# EAGLE design breadBUG_v1 (EAGLE 6.1)
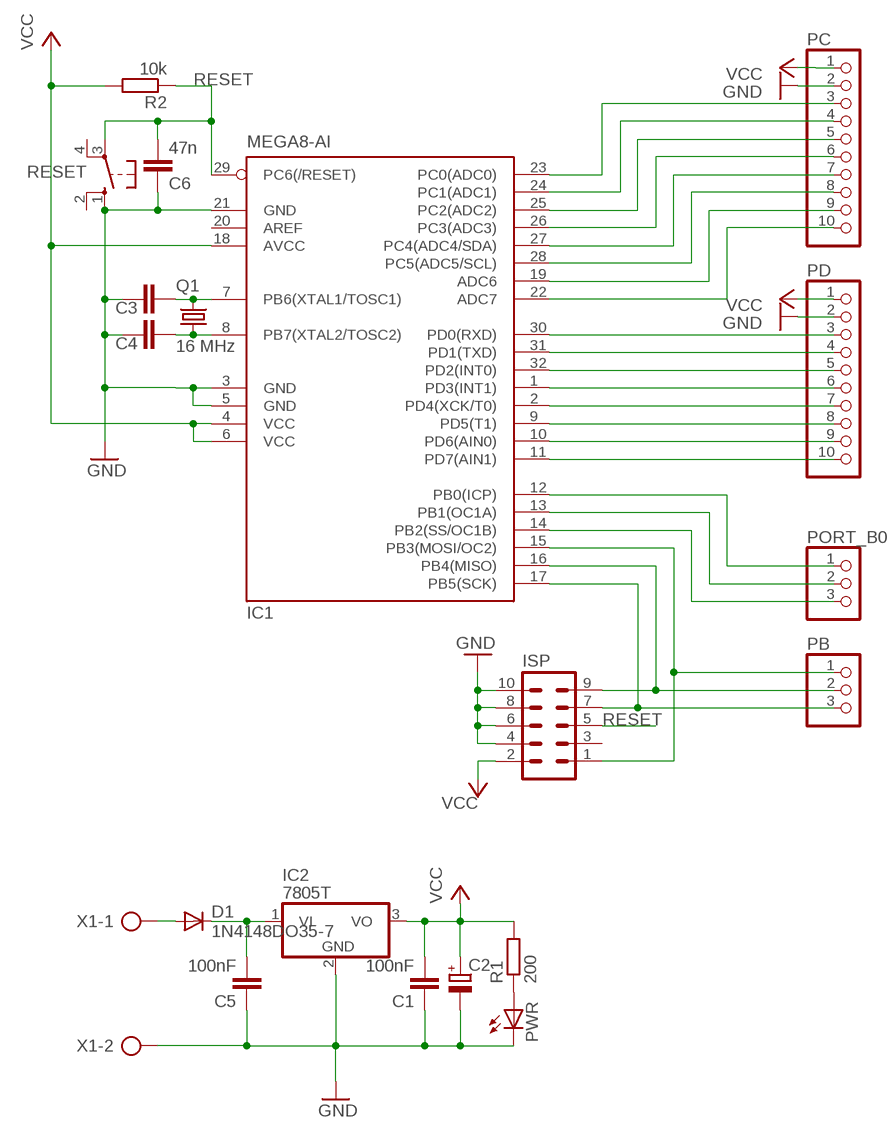
[diagram p0: schematic, sheet 1]

## Parts
C1  100nF  C2.5/2  [C2.5-2]
C2  CPOL-EUE2.5-6  [E2,5-6]
C3  C-EU025-025X050  [C025-025X050]
C4  C-EU025-025X050  [C025-025X050]
C5  100nF  C2.5/2  [C2.5-2]
C6  47n  C-EU025-025X050  [C025-025X050]
D1  1N4148DO35-7  [DO35-7]
IC1  MEGA8-AI  [TQFP32-08]
IC2  7805T  [TO220H]
ISP  MA05-2  [MA05-2]
PB  PINHD-1X3  [1X03]
PC  PINHD-1X10  [1X10]
PD  PINHD-1X10  [1X10]
PORT_B0  PINHD-1X3  [1X03]
PWR  LED3MM  [LED3MM]
Q1  16 MHz  CRYSTALHC49U-V  [HC49U-V]
R1  200  R-EU_0204/2V  [0204V]
R2  10k  R-EU_0204/2V  [0204V]
RESET  10-XX  [B3F-10XX]
X1  AK500/2  [AK500/2]

## Nets
GND: C1.1 C2.- C3.1 C4.1 C5.1 C6.1 IC1.3(GND) IC1.5(GND) IC1.21(GND) IC2.2(GND) ISP.4 ISP.6 ISP.8 ISP.10 PC.2 PD.2 PWR.K(C) RESET.1(S) X1.2
N$2: C3.2 IC1.7(PB6(XTAL1/TOSC1)) Q1.2
N$3: C4.2 IC1.8(PB7(XTAL2/TOSC2)) Q1.1
N$4: PWR.A R1.1
N$7: C5.2 D1.C IC2.1(VI)
N$8: D1.A X1.1
PB0: IC1.12(PB0(ICP)) PORT_B0.1
PB1: IC1.13(PB1(OC1A)) PORT_B0.2
PB2: IC1.14(PB2(SS/OC1B)) PORT_B0.3
PB3: IC1.15(PB3(MOSI/OC2)) ISP.1 PB.1
PB4: IC1.16(PB4(MISO)) ISP.9 PB.2
PB5: IC1.17(PB5(SCK)) ISP.7 PB.3
PC0: IC1.23(PC0(ADC0)) PC.3
PC1: IC1.24(PC1(ADC1)) PC.4
PC2: IC1.25(PC2(ADC2)) PC.5
PC3: IC1.26(PC3(ADC3)) PC.6
PC4: IC1.27(PC4(ADC4/SDA)) PC.7
PC5: IC1.28(PC5(ADC5/SCL)) PC.8
PC6: IC1.19(ADC6) PC.9
PC7: IC1.22(ADC7) PC.10
PD0: IC1.30(PD0(RXD)) PD.3
PD1: IC1.31(PD1(TXD)) PD.4
PD2: IC1.32(PD2(INT0)) PD.5
PD3: IC1.1(PD3(INT1)) PD.6
PD4: IC1.2(PD4(XCK/T0)) PD.7
PD5: IC1.9(PD5(T1)) PD.8
PD6: IC1.10(PD6(AIN0)) PD.9
PD7: IC1.11(PD7(AIN1)) PD.10
RESET: C6.2 IC1.29(PC6(/RESET)) ISP.5 R2.1 RESET.3(P)
VCC: C1.2 C2.+ IC1.4(VCC) IC1.6(VCC) IC1.18(AVCC) IC2.3(VO) ISP.2 PC.1 PD.1 R1.2 R2.2
Unconnected: IC1.20(AREF) ISP.3 RESET.2(S1) RESET.4(P1)

## Library data of the parts
C1 C5 = capacitor-wima:C: CAPACITOR naming: grid - package width
C2 = rcl:CPOL-EU: POLARIZED CAPACITOR, European symbol
C3 C4 C6 = rcl:C-EU: CAPACITOR, European symbol
D1 = diode:1N4148: DIODE high speed (Philips)
IC1 = atmel:MEGA8: MICROCONTROLLER 8 Kbytes FLASH, 1 kbytes SRAM, 512 bytes EEPROM, USART, 6-channel 10 bit ADC, 2-channel 8 bit ADC Pin compatible with Atmega48, ATMega88, ATMega168 Source: avr.lbr; MPN: ATMEGA8-16AU; OC_FARNELL: 9171371; OC_NEWARK: 73M8863
IC2 = linear:78*: Positive VOLTAGE REGULATOR Source: http://cache.national.com/ds/LM/LM78L05.pdf http://www.fairchildsemi.com/ds/LM/LM7805.pdf
ISP = con-lstb:MA05-2: PIN HEADER; OC_FARNELL: unknown; OC_NEWARK: unknown
PB PORT_B0 = pinhead:PINHD-1X3: PIN HEADER
PC PD = pinhead:PINHD-1X10: PIN HEADER
PWR = led:LED: LED OSRAM: - CHIPLED LG R971, LG N971, LY N971, LG Q971, LY Q971, LO R971, LY R971 LH N974, LH R974 LS Q976, LO Q976, LY Q976 LO Q996 - Hyper CHIPLED LW Q18S LB Q993, LB Q99A, LB R99A - SideLED LS A670, LO A670, LY A670, LG A670, LP A670 LB A673, LV A673, LT A673, LW A673 LH A674 LY A675 LS A676, LA A676, LO A676, LY A676, LW A676 LS A679, LY A679, LG A679 - Hyper Micro SIDELED® LS Y876, LA Y876, LO Y876, LY Y876 LT Y87S - SmartLED LW L88C, LW L88S LB L89C, LB L89S, LG L890 LS L89K, LO L89K, LY L89K LS L896, LA L896, LO L896, LY L896 - TOPLED LS T670, LO T670, LY T670, LG T670, LP T670 LSG T670, LSP T670, LSY T670, LOP T670, LYG T670 LG T671, LOG T671, LSG T671 LB T673, LV T673, LT T673, LW T673 LH T674 LS T676, LA T676, LO T676, LY T676, LB T676, LH T676, LSB T676, LW T676 LB T67C, LV T67C, LT T67C, LS T67K, LO T67K, LY T67K, LW E67C LS E67B, LA E67B, LO E67B, LY E67B, LB E67C, LV E67C, LT E67C LW T67C LS T679, LY T679, LG T679 LS T770, LO T770, LY T770, LG T770, LP T770 LB T773, LV T773, LT T773, LW T773 LH T774 LS E675, LA E675, LY E675, LS T675 LS T776, LA T776, LO T776, LY T776, LB T776 LHGB T686 LT T68C, LB T68C - Hyper Mini TOPLED® LB M676 - Mini TOPLED Santana® LG M470 LS M47K, LO M47K, LY M47K Source: http://www.osram.convergy.de LUXEON: - LUMILED® LXK2-PW12-R00, LXK2-PW12-S00, LXK2-PW14-U00, LXK2-PW14-V00 LXK2-PM12-R00, LXK2-PM12-S00, LXK2-PM14-U00 LXK2-PE12-Q00, LXK2-PE12-R00, LXK2-PE12-S00, LXK2-PE14-T00, LXK2-PE14-U00 LXK2-PB12-K00, LXK2-PB12-L00, LXK2-PB12-M00, LXK2-PB14-N00, LXK2-PB14-P00, LXK2-PB14-Q00 LXK2-PR12-L00, LXK2-PR12-M00, LXK2-PR14-Q00, LXK2-PR14-R00 LXK2-PD12-Q00, LXK2-PD12-R00, LXK2-PD12-S00 LXK2-PH12-R00, LXK2-PH12-S00 LXK2-PL12-P00, LXK2-PL12-Q00, LXK2-PL12-R00 Source: www.luxeon.com KINGBRIGHT: KA-3528ASYC Source: www.kingbright.com
Q1 = crystal:CRYSTAL: CRYSTAL; OC_FARNELL: 1666969; OC_NEWARK: unknown
R1 R2 = rcl:R-EU_: RESISTOR, European symbol
RESET = switch-omron:10-XX: OMRON SWITCH; MPN: B3F-1000; OC_FARNELL: 176432; OC_NEWARK: 36M3542
X1 = con-ptr500:AK500/2: CONNECTOR; OC_FARNELL: unknown; OC_NEWARK: unknown

## Board
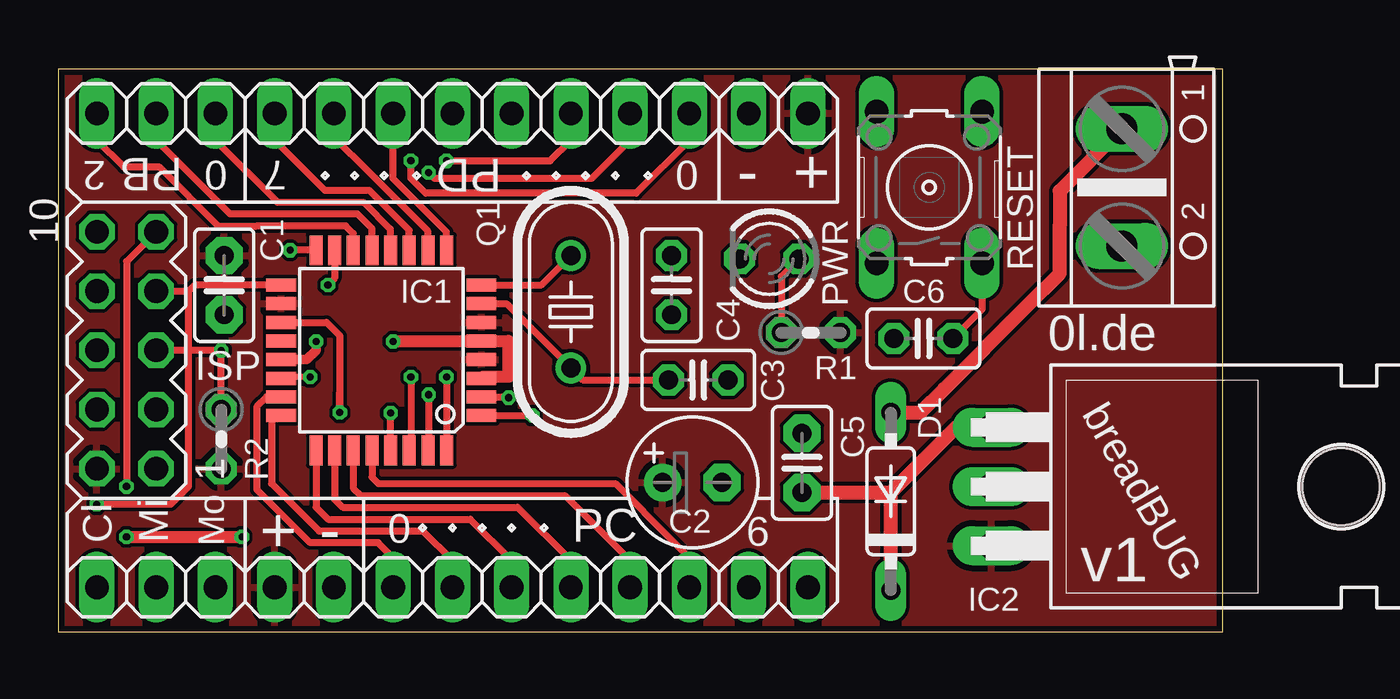
[diagram p1: board, top side]
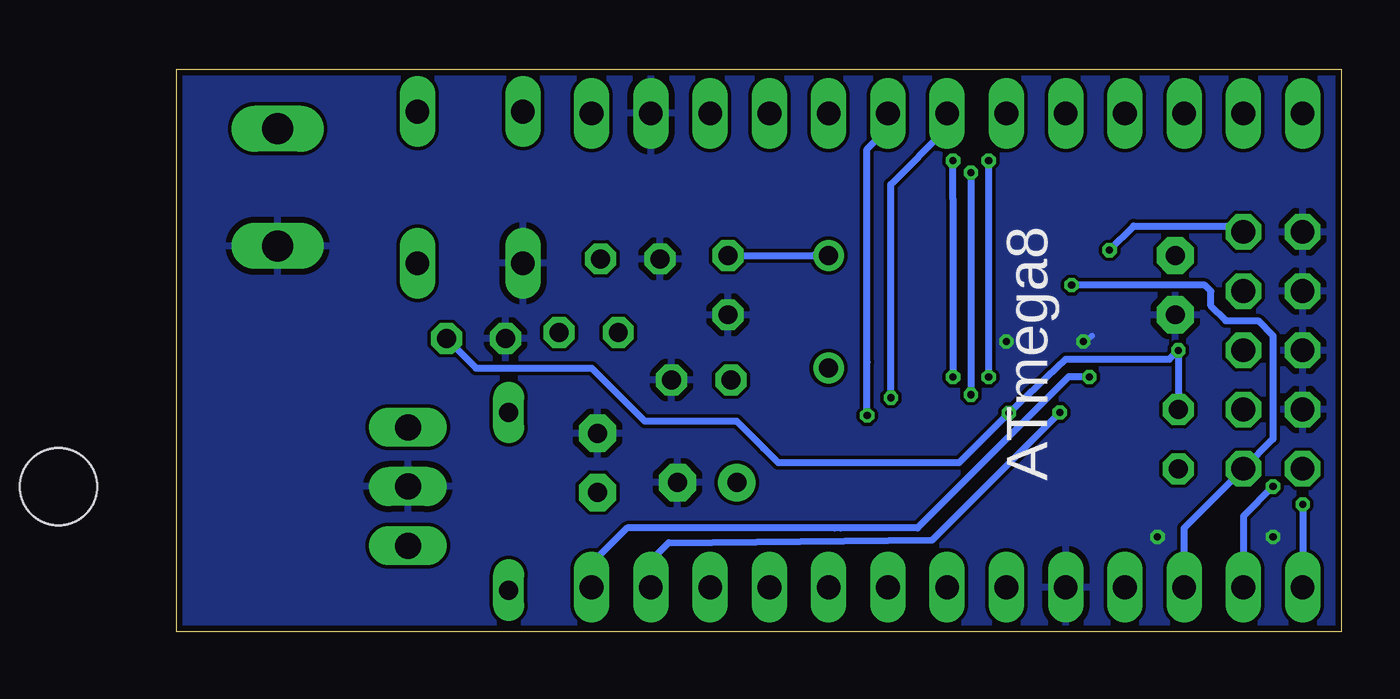
[diagram p2: board, bottom side, seen from below]

Size 49.91 x 24.13 mm. Coordinates in mm from the lower left corner, seen from the top.
Outline: 0,0 49.91,0 49.91,24.13 0,24.12 0,0
Copper layers (1*16): Top 0.035mm / dielectric 1.5mm / Bottom 0.035mm
Design rules: minimum track width 6mil, minimum drill 12mil, track to track 6mil, track to pad 6mil, pad to pad 6mil, via to via 6mil, smd to smd 0mil, copper to edge 10mil, drill to drill 10mil, minimum pad ring 10mil, minimum via ring 6mil, stop-mask expansion 2mil, vias tented up to drill 100mil, thermal gap 10mil

### Footprints (pad centres in the part's own frame; a part is rotated, then mirrored left to right if it is on the bottom)
C2.5-2 = drill 0.813 pad 1.6 octagon: 1 -1.27,0; 2 1.27,0
E2,5-6 = drill 0.813 pad 1.6: + -1.27,0 | drill 0.813 pad 1.6 octagon: - 1.27,0
C025-025X050 = drill 0.813 octagon: 1 -1.27,0; 2 1.27,0
DO35-7 = drill 0.813 long: A 3.81,0; C -3.81,0
TQFP32-08 = smd 1.27 x 0.559: 1 -4.293,2.8; 2 -4.293,2; 3 -4.293,1.2; 4 -4.293,0.4; 5 -4.293,-0.4; 6 -4.293,-1.2; 7 -4.293,-2; 8 -4.293,-2.8; 17 4.293,-2.8; 18 4.293,-2; 19 4.293,-1.2; 20 4.293,-0.4; 21 4.293,0.4; 22 4.293,1.2; 23 4.293,2; 24 4.293,2.8 | smd 0.559 x 1.27: 9 -2.8,-4.293; 10 -2,-4.293; 11 -1.2,-4.293; 12 -0.4,-4.293; 13 0.4,-4.293; 14 1.2,-4.293; 15 2,-4.293; 16 2.8,-4.293; 25 2.8,4.293; 26 2,4.293; 27 1.2,4.293; 28 0.4,4.293; 29 -0.4,4.293; 30 -1.2,4.293; 31 -2,4.293; 32 -2.8,4.293
TO220H = drill 1.118 long: 1 -2.54,-10.16; 2 0,-10.16; 3 2.54,-10.16 | hole 3.302: 0,4.826
MA05-2 = drill 1.016 octagon: 1 -5.08,-1.27; 2 -5.08,1.27; 3 -2.54,-1.27; 4 -2.54,1.27; 5 0,-1.27; 6 0,1.27; 7 2.54,-1.27; 8 2.54,1.27; 9 5.08,-1.27; 10 5.08,1.27
1X03 = drill 1.016 long: 1 -2.54,0; 2 0,0; 3 2.54,0
1X10 = drill 1.016 long: 1 -11.43,0; 2 -8.89,0; 3 -6.35,0; 4 -3.81,0; 5 -1.27,0; 6 1.27,0; 7 3.81,0; 8 6.35,0; 9 8.89,0; 10 11.43,0
LED3MM = drill 0.813 octagon: A -1.27,0; K 1.27,0
HC49U-V = drill 0.813: 1 -2.413,0; 2 2.413,0
0204V = drill 0.813 octagon: 1 -1.27,0; 2 1.27,0
B3F-10XX = drill 1.016 long: 1 -3.251,2.261; 2 3.251,2.261; 3 -3.251,-2.261; 4 3.251,-2.261
AK500/2 = drill 1.321 long: 1 -2.515,0; 2 2.515,0

### Placement (x,y rotation side)
C1  7.11,14.86 90 top
C2  27.18,6.39 0 top
C3  27.43,10.79 180 top
C4  26.29,14.86 90 top
C5  31.88,7.24 270 top
C6  37.08,12.57 0 top
D1  35.69,5.59 90 top
IC1  13.84,12.06 180 top
IC2  50.16,6.22 270 top
ISP  2.92,12.06 90 top
PB  4.19,1.91 180 top
PC  20.7,1.91 0 top
PD  20.7,22.23 180 top
PORT_B0  4.19,22.23 180 top
PWR  30.47,15.99 180 top
Q1  21.97,13.72 270 top
R1  32.26,12.83 0 top
R2  6.99,8.26 270 top
RESET  37.34,19.05 90 top
X1  45.59,19.05 270 top

### Tracks (layer width: path | path; a pad name or v marks a point on that pad's centre or on a via)
GND  (via drill 0.3)
  Top 0.406: IC1.21 10.65,11.66 11.05,12.06 v11.05,12.45
  Top 0.508: v2.92,4.06 3.17,4.06 v7.87,4.06 | IC1.5 19.29,12.46 19.3,12.45 | 19.3,12.45 19.3,10.92 | 19.3,10.92 18.19,10.92 IC1.3 | 19.3,10.92 19.3,12.45 | 19.3,12.45 v14.35,12.45
  Bottom 0.254: v11.05,12.45 10.67,12.7
  pour Bottom: 0,24.13 49.91,24.13 49.91,0 0,0
N$2
  Top 0.305: IC1.7 19.21,14.06 Q1.2 22.48,10.79 C3.2
N$3
  Top 0.305: IC1.8 20.71,14.87 Q1.1
  Bottom 0.305: C4.2 22.61,16.13 Q1.1
N$4
  Top 0.305: PWR.A 30.99,15.23 R1.1
N$7
  Top 0.61: C5.2 35.69,5.97 | 35.69,5.97 38.48,8.76 IC2.1 | D1.C 35.69,5.21 35.69,5.97
N$8
  Top 0.61: D1.A 36.96,9.4 37.97,10.41 41.53,13.97 42.93,15.37 42.93,17.4 42.93,18.9 X1.1
PB0
  Top 0.305: PORT_B0.1 6.73,21.08 9.4,18.41 13.08,18.41 14.22,17.27 14.22,16.38 IC1.12
PB1
  Top 0.305: IC1.13 13.44,17.29 12.95,17.78 12.83,17.91 8.76,17.91 7.37,17.91 4.19,21.08 PORT_B0.2
PB2
  Top 0.305: PORT_B0.3 1.65,21.08 2.79,19.94 4.32,19.94 6.86,17.4 8.51,17.4 12.32,17.4 12.64,17.07 IC1.14
PB3  (via drill 0.3)
  Top 0.305: IC1.15 11.84,15.14 v11.56,14.86
  Bottom 0.305: v11.56,14.86 5.84,14.86 5.59,14.61 5.59,13.97 4.95,13.34 3.56,13.34 2.92,12.7 2.92,8.26 ISP.1 6.73,4.45 PB.1
PB4  (via drill 0.3)
  Top 0.305: ISP.9 2.92,15.88 v2.92,6.22 | IC1.16 v9.93,16.36
  Bottom 0.305: v2.92,6.22 4.19,4.95 PB.2 | v9.93,16.36 8.89,17.4 4.45,17.4 ISP.9
PB5  (via drill 0.3)
  Top 0.305: IC1.17 5.85,14.87 5.59,14.61 | ISP.7 5.59,14.61 | v1.65,5.46 4.83,5.46 5.59,6.22 5.59,14.61
  Bottom 0.305: v1.65,5.46 PB.3
PC0
  Top 0.305: PC.3 14.35,3.17 13.72,3.81 10.79,3.81 8.51,6.1 8.51,9.65 8.92,10.06 IC1.23
PC1
  Top 0.305: IC1.24 9.55,9.17 9.17,9.3 9.14,9.27 9.14,6.35 11.18,4.32 15.62,4.32 16.89,3.05 PC.4
PC2
  Top 0.305: IC1.25 11.04,5.34 11.56,4.83 17.65,4.83 19.43,3.05 PC.5
PC3
  Top 0.305: IC1.26 11.84,5.68 12.19,5.33 19.68,5.33 21.97,3.05 PC.6
PC4
  Top 0.305: IC1.27 12.64,6.15 12.95,5.84 21.72,5.84 24.51,3.05 PC.7
PC5
  Top 0.305: IC1.28 13.44,6.62 13.72,6.35 23.88,6.35 26.29,3.94 27.05,3.17 PC.8
PC6  (via drill 0.3)
  Top 0.305: IC1.19 11.5,13.27 12.06,12.7 12.06,10.29 | 12.06,10.29 v12.06,9.4 12.06,10.29
  Bottom 0.305: PC.9 29.59,3.05 28.83,3.81 17.53,3.94 v12.06,9.4
PC7  (via drill 0.3)
  Top 0.254: v10.79,10.92 9.61,10.92 IC1.22
  Bottom 0.305: PC.10 32.13,2.92 32,3.05 30.61,4.45 21.72,4.45 21.46,4.45 18.16,4.45 11.68,10.92 v10.79,10.92
PD0  (via drill 0.3)
  Top 0.305: PD.3 27.05,21.08 24.77,18.8 15.75,18.8 15.11,19.43 v15.11,20.19 | v15.11,10.92 15.11,7.84 IC1.30
  Bottom 0.305: v15.11,20.19 v15.11,10.92
PD1  (via drill 0.3)
  Top 0.305: PD.4 24.51,21.08 22.86,19.43 16.13,19.43 v15.88,19.68 | v15.88,10.16 15.88,7.8 IC1.31
  Bottom 0.305: v15.88,19.68 v15.88,10.16
PD2  (via drill 0.3)
  Top 0.305: PD.5 21.97,21.08 21.08,20.19 v16.64,20.19 | v16.64,10.92 IC1.32
  Bottom 0.305: v16.64,10.92 16.64,18.54 v16.64,20.19
PD3  (via drill 0.3)
  Top 0.305: IC1.1 19.3,9.27 v20.32,9.27
  Bottom 0.305: v20.32,9.27 20.32,11.56 20.32,20.7 19.43,21.59 PD.6
PD4  (via drill 0.3)
  Top 0.305: IC1.2 19.08,10.06 v19.3,10.03
  Bottom 0.305: v19.3,10.03 19.3,19.18 16.89,21.59 PD.7
PD5
  Top 0.305: IC1.9 16.64,17.14 14.35,19.43 PD.8
PD6
  Top 0.305: IC1.10 15.84,17.18 13.46,19.56 13.34,19.68 11.81,21.21 PD.9
PD7
  Top 0.305: IC1.11 15.04,17.21 13.34,18.92 11.43,18.92 9.27,21.08 PD.10
RESET  (via drill 0.3)
  Top 0.305: RESET.3 39.6,13.82 C6.2 | R2.1 v6.99,12.06 4.7,12.06 ISP.5 | 14.22,7.75 IC1.29 v14.24,9.38
  Bottom 0.305: R2.1 v6.99,12.06 7.37,11.68 11.18,11.68 11.81,11.68 14.22,9.4 v14.24,9.38 16.38,7.24 18.16,7.24 24.13,7.24 24.77,7.87 25.91,9.02 29.84,9.02 32.13,11.3 37.08,11.3 C6.2
VCC
  pour Top: 0,24.13 49.91,24.13 49.91,0 0,0

### Text on the board
tPlace: 2 | PB | 0 | 7 | 0 | - | + | 0l.de | 0 | 6 | Cl | Mi | Mo | + | - | breadBUG | v1
bPlace: ATmega8